# Altium project Node_TrashTrack.PrjPcb
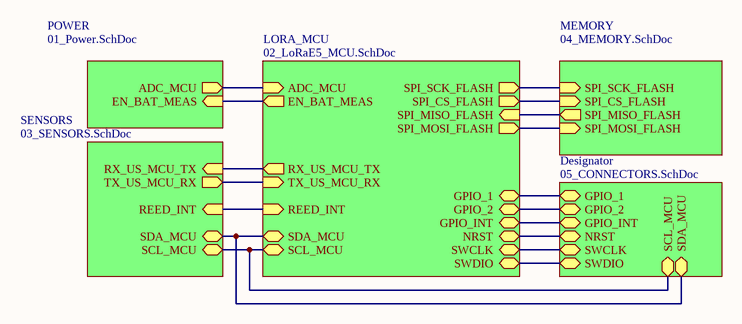
[diagram p0: 00_TOP.SchDoc]
5 sheets, 37 parts. Net scope: hierarchical (ports join the sheet entries above them; power ports are global).
Board file: Node_TrashTrack.PcbDoc
Sheets:
  00_TOP.SchDoc
    POWER = 01_Power.SchDoc
    LORA_MCU = 02_LoRaE5_MCU.SchDoc
    SENSORS = 03_SENSORS.SchDoc
    Designator = 05_CONNECTORS.SchDoc

## Sheet 00_TOP.SchDoc
size A4; SheetNumber: 1; SheetTotal: 6

### Sub-sheets
Designator = 05_CONNECTORS.SchDoc: SDA_MCU (bidir), SCL_MCU (bidir), GPIO_1 (bidir), GPIO_2 (bidir), GPIO_INT (bidir), SWCLK (bidir), SWDIO (bidir), NRST (bidir)
LORA_MCU = 02_LoRaE5_MCU.SchDoc: SCL_MCU (bidir), SDA_MCU (bidir), RX_US_MCU_TX (out), TX_US_MCU_RX (in), SPI_SCK_FLASH (out), SPI_MISO_FLASH (in), SPI_MOSI_FLASH (out), SPI_CS_FLASH (out), ADC_MCU (in), EN_BAT_MEAS (out), SWCLK (bidir), SWDIO (bidir), GPIO_1 (bidir), GPIO_2 (bidir), GPIO_INT (bidir), REED_INT (in), NRST (bidir)
MEMORY = 04_MEMORY.SchDoc (file not in this document): SPI_MISO_FLASH (out), SPI_MOSI_FLASH (in), SPI_SCK_FLASH (in), SPI_CS_FLASH (in)
POWER = 01_Power.SchDoc: ADC_MCU (out), EN_BAT_MEAS (in)
SENSORS = 03_SENSORS.SchDoc: RX_US_MCU_TX (in), TX_US_MCU_RX (out), SDA_MCU (bidir), SCL_MCU (bidir), REED_INT (in)

### Nets
bat_ADC: sheet POWER/ADC_MCU, sheet LORA_MCU/ADC_MCU
EN_BAT_MEAS_N: sheet POWER/EN_BAT_MEAS, sheet LORA_MCU/EN_BAT_MEAS
NRST: sheet LORA_MCU/NRST, sheet Designator/NRST
REED_INT: sheet LORA_MCU/REED_INT, sheet SENSORS/REED_INT
RX_US: sheet LORA_MCU/RX_US_MCU_TX, sheet SENSORS/RX_US_MCU_TX
SCL_MCU: sheet LORA_MCU/SCL_MCU, sheet SENSORS/SCL_MCU, sheet Designator/SCL_MCU
SDA_MCU: sheet LORA_MCU/SDA_MCU, sheet SENSORS/SDA_MCU, sheet Designator/SDA_MCU
SWCLK: sheet LORA_MCU/SWCLK, sheet Designator/SWCLK
SWDIO: sheet LORA_MCU/SWDIO, sheet Designator/SWDIO
TX_US: sheet LORA_MCU/TX_US_MCU_RX, sheet SENSORS/TX_US_MCU_RX
NetJ7_5: sheet LORA_MCU/GPIO_1, sheet Designator/GPIO_1
NetJ7_7: sheet LORA_MCU/GPIO_2, sheet Designator/GPIO_2
NetJ7_8: sheet LORA_MCU/GPIO_INT, sheet Designator/GPIO_INT
NetU3_24: sheet LORA_MCU/SPI_SCK_FLASH, sheet MEMORY/SPI_SCK_FLASH
NetU3_25: sheet LORA_MCU/SPI_CS_FLASH, sheet MEMORY/SPI_CS_FLASH
NetU3_26: sheet LORA_MCU/SPI_MISO_FLASH, sheet MEMORY/SPI_MISO_FLASH
NetU3_27: sheet LORA_MCU/SPI_MOSI_FLASH, sheet MEMORY/SPI_MOSI_FLASH

## Sheet 01_Power.SchDoc
size A4; SheetNumber: 3; SheetTotal: 6
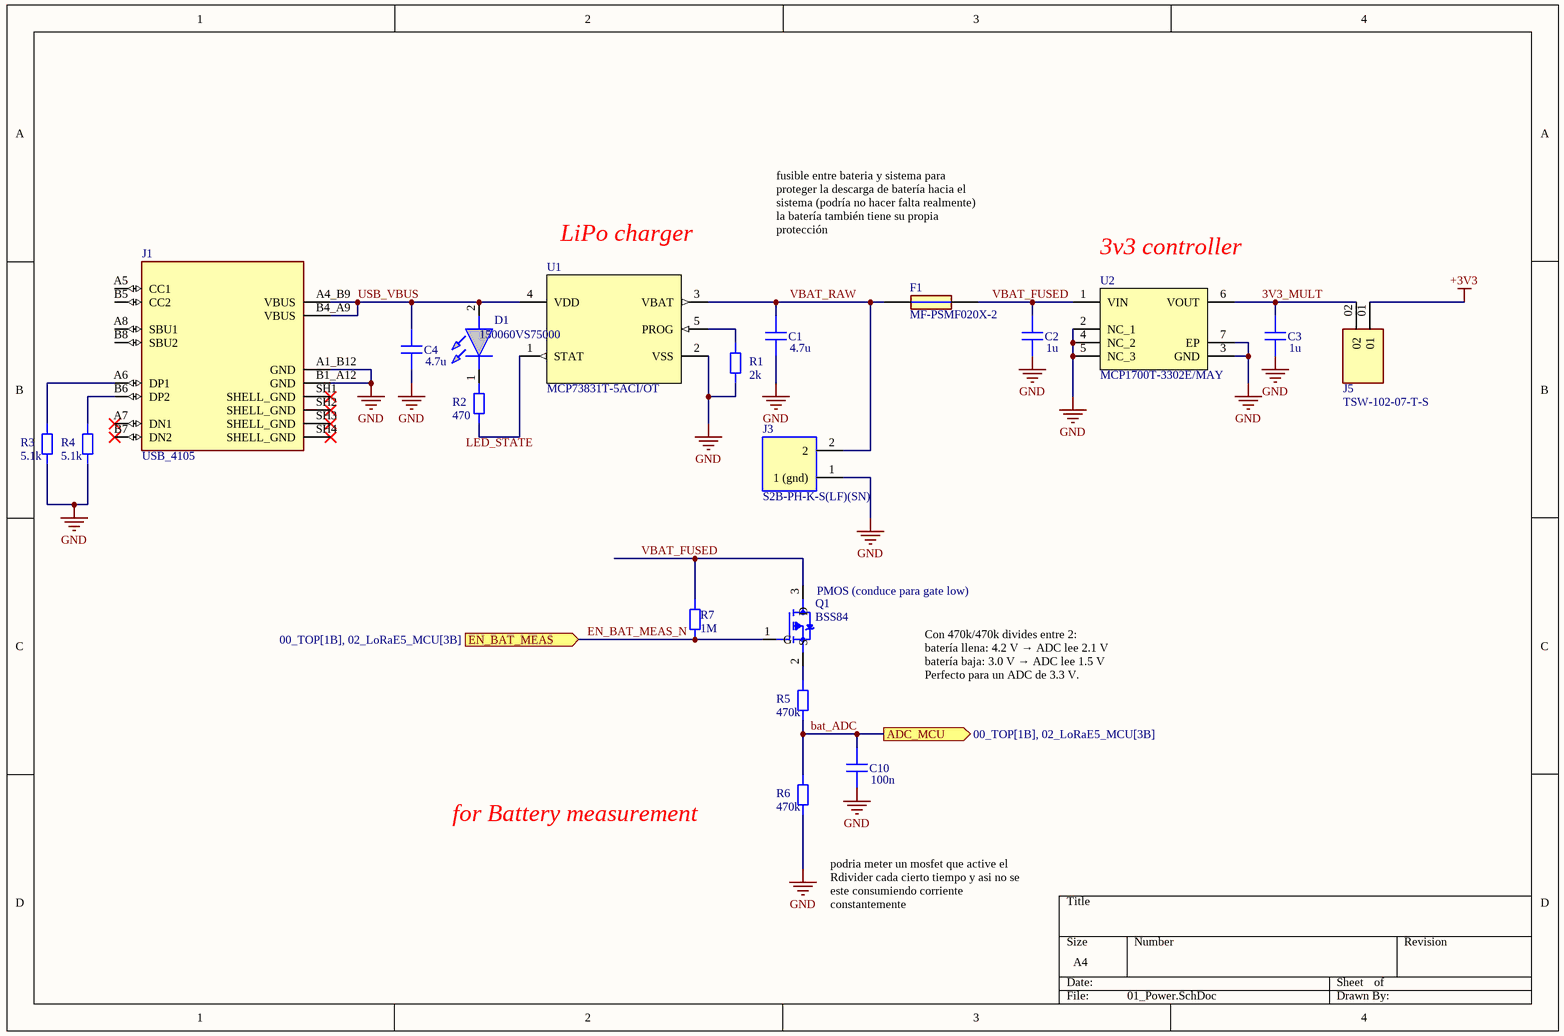
[diagram p1: 01_Power.SchDoc]

### Parts
C1  4.7u  [Capacitor_SMD:0603_1608m]
C2  1u  [Capacitor_SMD:0603_1608m]
C3  1u  [Capacitor_SMD:0603_1608m]
C4  4.7u  [Capacitor_SMD:0603_1608m]
C10  100n  [Capacitor_SMD:0603_1608m]
D1  150060VS75000  [LEDC1608X70N]
F1  MF-PSMF020X-2  [MF-PSMF020X-2]
J1  USB_4105  [USB4105-GF-A]
J3  S2B-PH-K-S(LF)(SN)  [S2B-PH-K-S(LF)(SN)]
J5  TSW-102-07-T-S  [TSW-102-07-T-S]
Q1  BSS84  [BS884]
R1  2k  [Resistor_SMD:0603_1608m]
R2  470  [Resistor_SMD:0603_1608m]
R3  5.1k  [Resistor_SMD:0603_1608m]
R4  5.1k  [Resistor_SMD:0603_1608m]
R5  470k  [Resistor_SMD:0603_1608m]
R6  470k  [Resistor_SMD:0603_1608m]
R7  1M  [Resistor_SMD:0603_1608m]
U1  MCP73831T-5ACI/OT  [MCP73831T-5ACI/OT]
U2  MCP1700T-3302E/MAY  [MCP1700T-3302E/MAY]

### Ports
ADC_MCU (out, see 00_TOP[1B], 02_LoRaE5_MCU[3B]), EN_BAT_MEAS (in, see 00_TOP[1B], 02_LoRaE5_MCU[3B])

### Nets
+3V3: J5.01
GND: C1.2 C2.2 C3.2 C4.2 C10.2 J1.A1_B12(GND) J1.B1_A12(GND) J3.1(1_(gnd)) R1.2 R3.2 R4.2 R6.2 U1.2(VSS) U2.2(NC_1) U2.3(GND) U2.4(NC_2) U2.5(NC_3) U2.7(EP)
3V3_MULT: C3.1 J5.02 U2.6(VOUT)
bat_ADC: C10.1 R5.2 R6.1 ; port ADC_MCU
EN_BAT_MEAS_N: Q1.1(G) R7.1 ; port EN_BAT_MEAS
USB_VBUS: C4.1 D1.2(A) J1.A4_B9(VBUS) J1.B4_A9(VBUS) U1.4(VDD)
VBAT_FUSED: C2.1 F1.2 Q1.3(D) R7.2 U2.1(VIN)
VBAT_RAW: C1.1 F1.1 J3.2 U1.3(VBAT)
NetD1_1: D1.1(K) R2.1
NetJ1_A6: J1.A6(DP1) R3.1
NetJ1_B6: J1.B6(DP2) R4.1
NetQ1_2: Q1.2(S) R5.1
NetR1_1: R1.1 U1.5(PROG)
NetR2_2: R2.2 U1.1(STAT)

Not connected (* = marked no-connect by the designer): J1 A5(CC1) A7(DN1)* A8(SBU1) B5(CC2) B7(DN2)* B8(SBU2) SH1(SHELL_GND)* SH2(SHELL_GND)* SH3(SHELL_GND)* SH4(SHELL_GND)*

### Notes on the sheet
- LiPo charger
- fusible entre bateria y sistema para proteger la descarga de batería hacia el sistema (podría no hacer falta realmente) la batería también tiene su propia protección
- (near U2) 3v3 controller
- (near Q1) PMOS (conduce para gate low)
- Con 470k/470k divides entre 2:
  batería llena: 4.2 V → ADC lee 2.1 V
  batería baja: 3.0 V → ADC lee 1.5 V
  Perfecto para un ADC de 3.3 V.
- for Battery measurement
- podria meter un mosfet que active el Rdivider cada cierto tiempo y asi no se este consumiendo corriente constantemente
- Labels drawn without touching a wire or pin: LED_STATE

### Library data of the parts
C1-C4 C10 = Generic_Capacitor
D1 = 150060VS75000: WL-SMCW SMT Mono-Color Chip LED Waterclear 0603, Bright Green, Typ.(@20mA): 570nm, 40mcd, 2.0V, 140 AlInGaP; Manufacturer_Name: Wurth Elektronik; Geometry.Height: 0.7mm; Manufacturer_Part_Number: 150060VS75000; Mouser Part Number: 710-150060VS75000; Mouser Price/Stock: https://www.mouser.co.uk/ProductDetail/Wurth-Elektronik/150060VS75000?qs=LlUlMxKIyB1Q1Bi5mQ%2FKLw%3D%3D; Arrow Part Number: *; Arrow Price/Stock: *; Datasheet Link: https://www.we-online.com/catalog/datasheet/150060VS75000.pdf
F1 = MF-PSMF020X-2: Manufacturer_Name: Bourns; Geometry.Height: 0.85mm; Manufacturer_Part_Number: MF-PSMF020X-2; Mouser Part Number: 652-MF-PSMF020X-2; Mouser Price/Stock: https://www.mouser.co.uk/ProductDetail/Bourns/MF-PSMF020X-2?qs=B2dI1vFk2x%2FnZ%252B%252BDoGvxDQ%3D%3D; Arrow Part Number: MF-PSMF020X-2; Arrow Price/Stock: https://www.arrow.com/en/products/mf-psmf020x-2/bourns?utm_currency=USD&region=europe; Datasheet Link: https://www.bourns.com/pdfs/mfpsmf.pdf
J5 = TSW-102-07-T-S: <a href="https://pricing.snapeda.com/parts/TSW-102-07-T-S/Samtec/view-part?ref=eda">Check availability</a>; MF: {'manufacturer': u'Samtec'}; Package: None; Price: None; Value: *; MP: TSW-102-07-T-S; Availability: Unavailable
Q1 = BSS84: P-Channel 50 V 130mA (Ta) 225mW (Ta) Surface Mount SOT-23-3 (TO-236); MF: onsemi; SnapEDA_Link: https://www.snapeda.com/parts/BSS84/Onsemi/view-part/?ref=snap; Package: None; Value: *; MP: BSS84; Check_prices: https://www.snapeda.com/parts/BSS84/Onsemi/view-part/?ref=eda
R1-R7 = Generic Resistor

## Sheet 02_LoRaE5_MCU.SchDoc
size A4; SheetNumber: 4; SheetTotal: 6
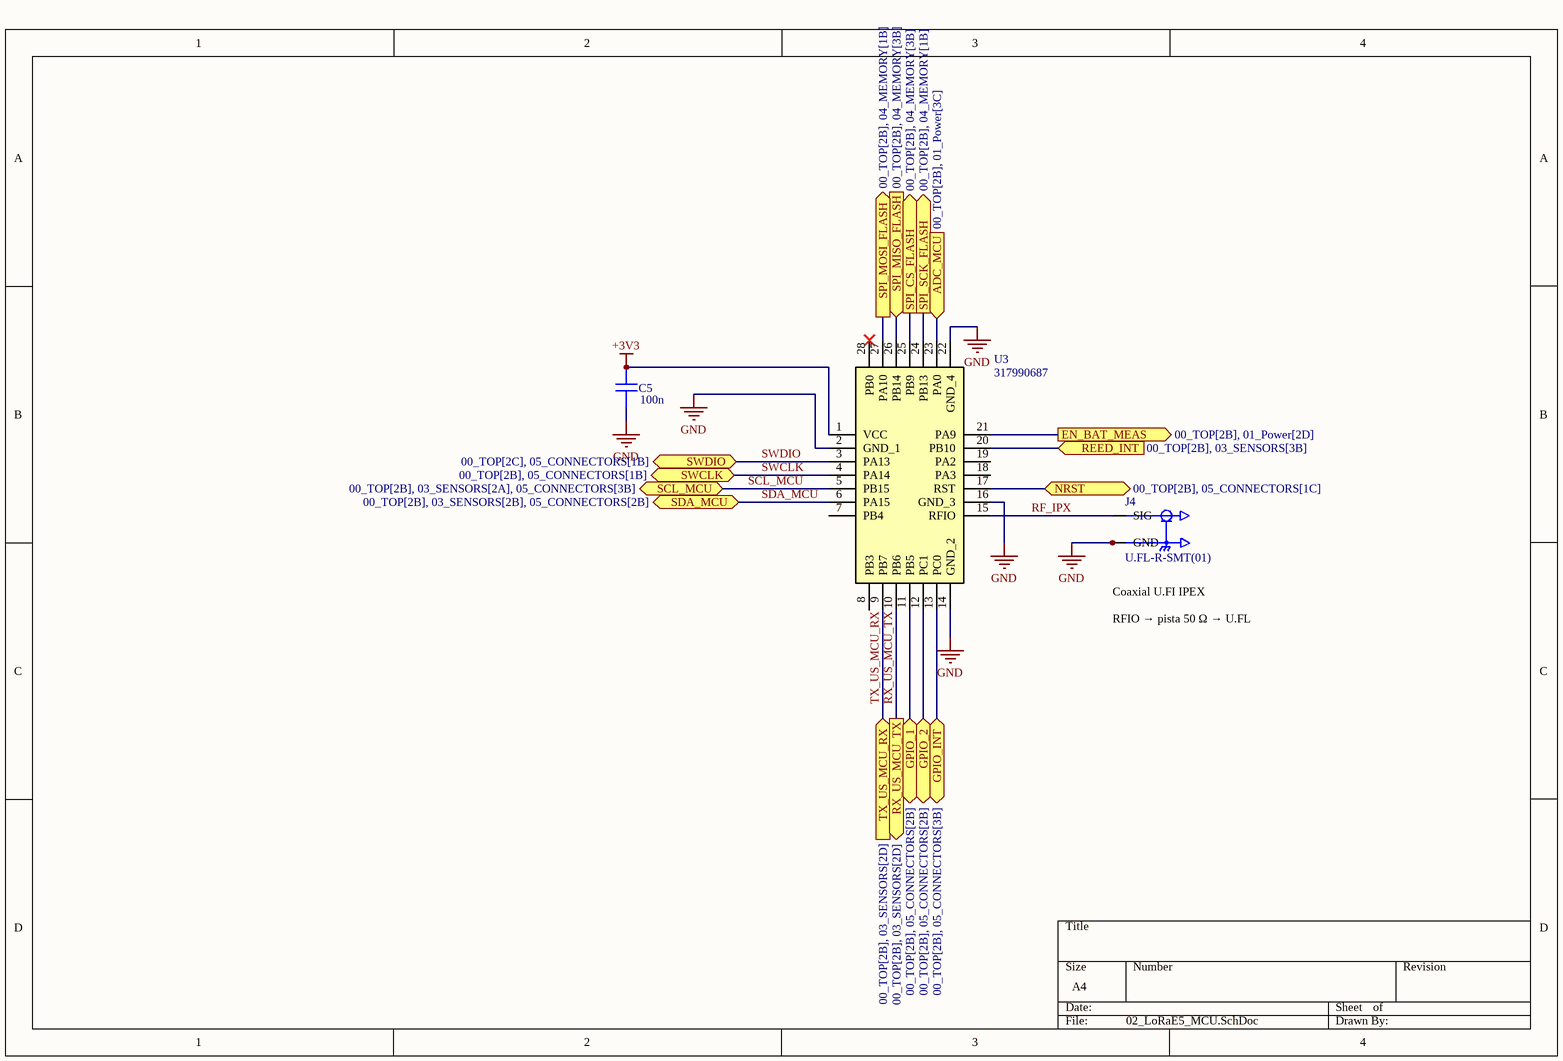
[diagram p2: 02_LoRaE5_MCU.SchDoc]

### Parts
C5  100n  [Capacitor_SMD:0603_1608m]
J4  U.FL-R-SMT(01)  [U.FL-R-SMT(01)]
U3  317990687  [317990687]

### Ports
ADC_MCU (in, see 00_TOP[2B], 01_Power[3C]), EN_BAT_MEAS (out, see 00_TOP[2B], 01_Power[2D]), GPIO_1 (bidir, see 00_TOP[2B], 05_CONNECTORS[2B]), GPIO_2 (bidir, see 00_TOP[2B], 05_CONNECTORS[2B]), GPIO_INT (bidir, see 00_TOP[2B], 05_CONNECTORS[3B]), NRST (bidir, see 00_TOP[2B], 05_CONNECTORS[1C]), REED_INT (in, see 00_TOP[2B], 03_SENSORS[3B]), RX_US_MCU_TX (out, see 00_TOP[2B], 03_SENSORS[2D]), SCL_MCU (bidir, see 00_TOP[2B], 03_SENSORS[2A], 05_CONNECTORS[3B]), SDA_MCU (bidir, see 00_TOP[2B], 03_SENSORS[2B], 05_CONNECTORS[2B]), SPI_CS_FLASH (out, see 00_TOP[2B], 04_MEMORY[3B]), SPI_MISO_FLASH (in, see 00_TOP[2B], 04_MEMORY[3B]), SPI_MOSI_FLASH (out, see 00_TOP[2B], 04_MEMORY[1B]), SPI_SCK_FLASH (out, see 00_TOP[2B], 04_MEMORY[1B]), SWCLK (bidir, see 00_TOP[2B], 05_CONNECTORS[1B]), SWDIO (bidir, see 00_TOP[2C], 05_CONNECTORS[1B]), TX_US_MCU_RX (in, see 00_TOP[2B], 03_SENSORS[2D])

### Nets
+3V3: C5.1 U3.1(VCC)
GND: C5.2 J4.1(GND) J4.2(GND) U3.2(GND_1) U3.14(GND_2) U3.16(GND_3) U3.22(GND_4)
bat_ADC: U3.23(PA0) ; port ADC_MCU
EN_BAT_MEAS_N: U3.21(PA9) ; port EN_BAT_MEAS
NRST: U3.17(RST) ; port NRST
REED_INT: U3.20(PB10) ; port REED_INT
RF_IPX: J4.3(SIG) U3.15(RFIO)
RX_US_MCU_TX: U3.10(PB6) ; port RX_US_MCU_TX  [project net RX_US]
SCL_MCU: U3.5(PB15) ; port SCL_MCU
SDA_MCU: U3.6(PA15) ; port SDA_MCU
SWCLK: U3.4(PA14) ; port SWCLK
SWDIO: U3.3(PA13) ; port SWDIO
TX_US_MCU_RX: U3.9(PB7) ; port TX_US_MCU_RX  [project net TX_US]
NetJ7_5: U3.11(PB5) ; port GPIO_1
NetJ7_7: U3.12(PC1) ; port GPIO_2
NetJ7_8: U3.13(PC0) ; port GPIO_INT
NetU3_24: U3.24(PB13) ; port SPI_SCK_FLASH
NetU3_25: U3.25(PB9) ; port SPI_CS_FLASH
NetU3_26: U3.26(PB14) ; port SPI_MISO_FLASH
NetU3_27: U3.27(PA10) ; port SPI_MOSI_FLASH

Not connected (* = marked no-connect by the designer): U3 7(PB4) 8(PB3) 18(PA3) 19(PA2) 28(PB0)*

### Notes on the sheet
- (near J4) Coaxial U.FI IPEX
- RFIO → pista 50 Ω → U.FL

### Library data of the parts
C5 = Generic_Capacitor
J4 = U.FL-R-SMT(01): MF: Hirose; Check_prices: https://www.snapeda.com/parts/U.FL-R-SMT(01)/Hirose+Electric+Co+Ltd/view-part/?ref=eda; Value: *; Availability: In Stock; MP: U.FL-R-SMT(01); Price: None; Package: None; SnapEDA_Link: https://www.snapeda.com/parts/U.FL-R-SMT(01)/Hirose+Electric+Co+Ltd/view-part/?ref=snap; Purchase-URL: https://pricing.snapeda.com/search/part/U.FL-R-SMT(01)/?ref=eda

## Sheet 03_SENSORS.SchDoc
size A4; SheetNumber: 5; SheetTotal: 6
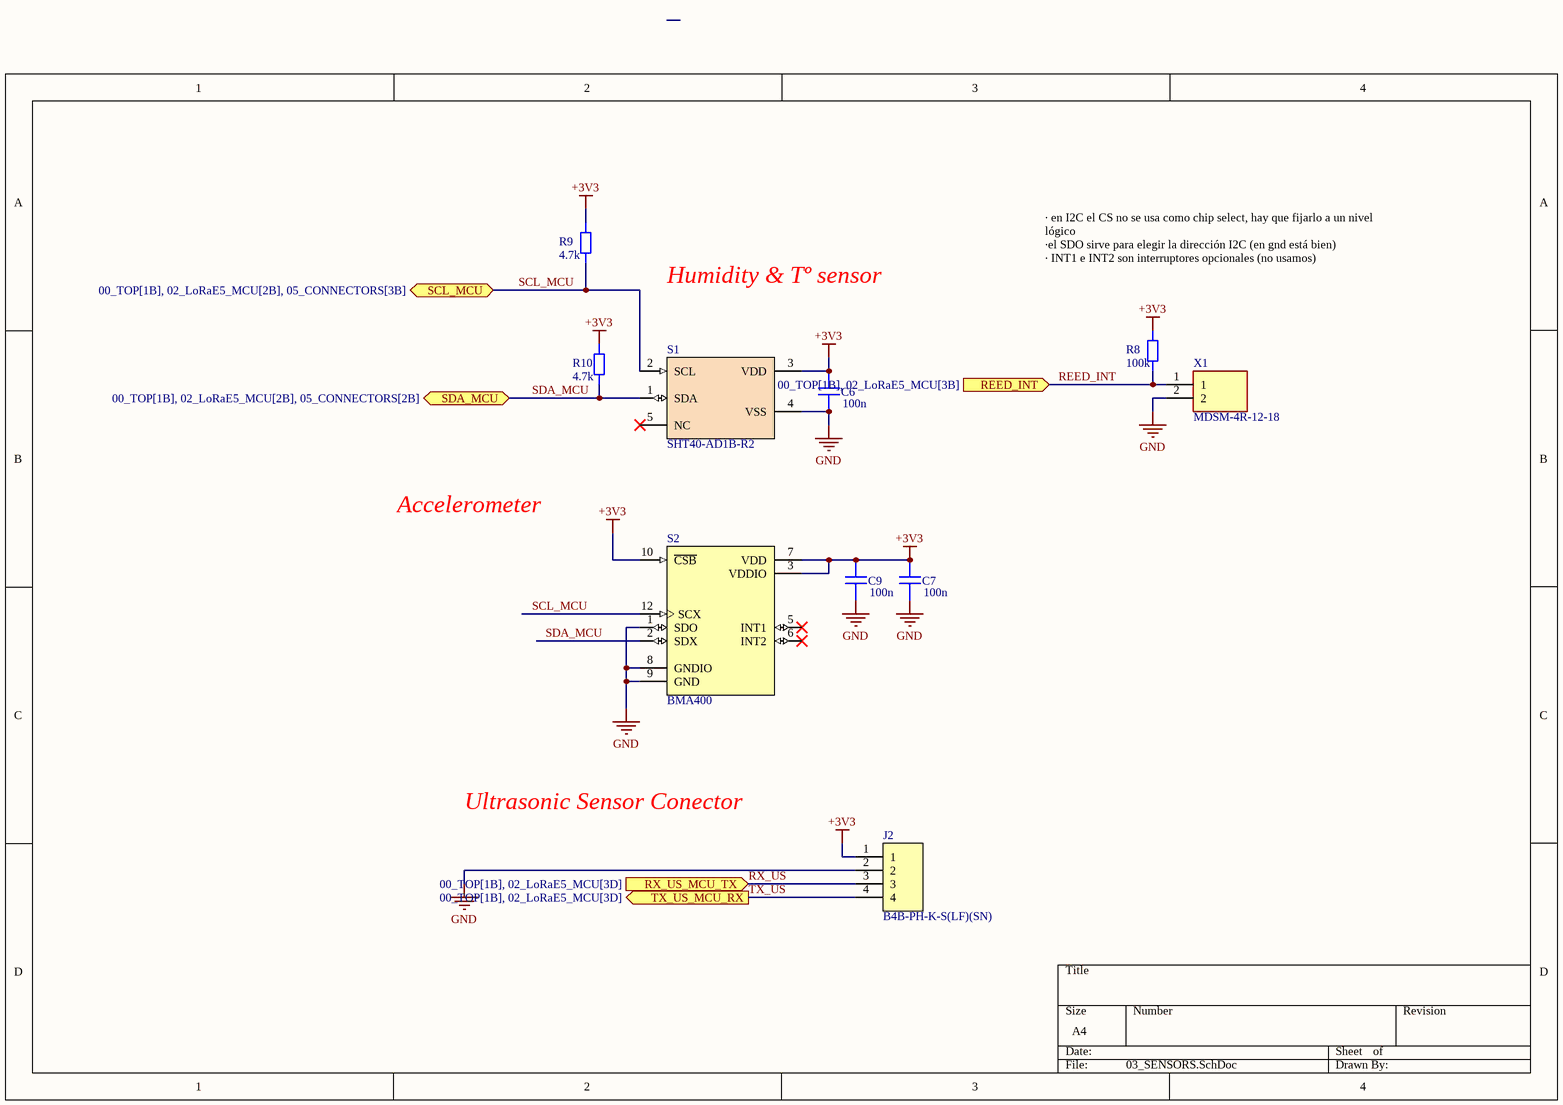
[diagram p3: 03_SENSORS.SchDoc]

### Parts
C6  100n  [Capacitor_SMD:0603_1608m]
C7  100n  [Capacitor_SMD:0603_1608m]
C9  100n  [Capacitor_SMD:0603_1608m]
J2  B4B-PH-K-S(LF)(SN)  [B4B-PH-K-S(LF)(SN)]
R8  100k  [Resistor_SMD:0603_1608m]
R9  4.7k  [Resistor_SMD:0603_1608m]
R10  4.7k  [Resistor_SMD:0603_1608m]
S1  SHT40-AD1B-R2  [SHT4x_SEN]
S2  BMA400  [BMA400]
X1  MDSM-4R-12-18  [MDSM4R1218]

### Ports
REED_INT (in, see 00_TOP[1B], 02_LoRaE5_MCU[3B]), RX_US_MCU_TX (in, see 00_TOP[1B], 02_LoRaE5_MCU[3D]), SCL_MCU (bidir, see 00_TOP[1B], 02_LoRaE5_MCU[2B], 05_CONNECTORS[3B]), SDA_MCU (bidir, see 00_TOP[1B], 02_LoRaE5_MCU[2B], 05_CONNECTORS[2B]), TX_US_MCU_RX (out, see 00_TOP[1B], 02_LoRaE5_MCU[3D])

### Nets
+3V3: C6.1 C7.1 C9.1 J2.1 R8.1 R9.1 R10.1 S1.3(VDD) S2.3(VDDIO) S2.7(VDD) S2.10(~{CSB})
GND: C6.2 C7.2 C9.2 J2.2 S1.4(VSS) S2.1(SDO) S2.8(GNDIO) S2.9(GND) X1.2
REED_INT: R8.2 X1.1 ; port REED_INT
RX_US: J2.3 ; port RX_US_MCU_TX
SCL_MCU: R9.2 S1.2(SCL) S2.12(SCX) ; port SCL_MCU
SDA_MCU: R10.2 S1.1(SDA) S2.2(SDX) ; port SDA_MCU
TX_US: J2.4 ; port TX_US_MCU_RX

Not connected (* = marked no-connect by the designer): S1 5(NC)*; S2 5(INT1)* 6(INT2)*

### Notes on the sheet
- Humidity & Tº sensor
- · en I2C el CS no se usa como chip select, hay que fijarlo a un nivel lógico
  ·el SDO sirve para elegir la dirección I2C (en gnd está bien)
  · INT1 e INT2 son interruptores opcionales (no usamos)
- Accelerometer
- Ultrasonic Sensor Conector

### Library data of the parts
C6 C7 C9 = Generic_Capacitor
R8-R10 = Generic Resistor
X1 = MDSM-4R-12-18: LITTELFUSE - MDSM-4R-12-18 - REED SW, SPST-NO, 0.5A, 200VDC, SMD; Geometry.Height: 2.84mm; Manufacturer_Name: LITTELFUSE; Manufacturer_Part_Number: MDSM-4R-12-18; Mouser Part Number: 934-MDSM-4R12-18; Mouser Price/Stock: https://www.mouser.co.uk/ProductDetail/Littelfuse/MDSM-4R-12-18?qs=nyo4TFax6NeuFOer0%2FvGlw%3D%3D; Arrow Part Number: MDSM-4R-12-18; Arrow Price/Stock: https://www.arrow.com/en/products/mdsm-4r-12-18/littelfuse?region=europe; Datasheet Link: https://media.digikey.com/pdf/DataSheets/HamlinPDFs/MDSM-4R.pdf

## Sheet 05_CONNECTORS.SchDoc
size A4; SheetNumber: 2; SheetTotal: 6
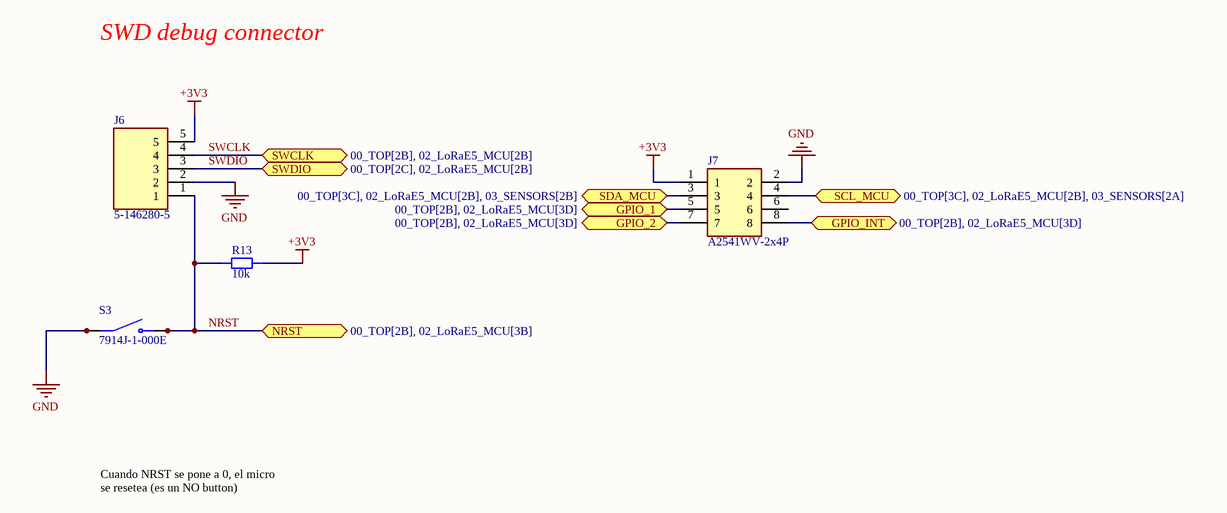
[diagram p4: 05_CONNECTORS.SchDoc]

### Parts
J6  5-146280-5  [HDRV5W67P0X254_1X5_1229X234X821P]
J7  A2541WV-2x4P  [TSW-104-XX-YY-D]
R13  10k  [Resistor_SMD:0603_1608m]
S3  7914J-1-000E  [SW_7914J-1-000E]

### Ports
GPIO_1 (bidir, see 00_TOP[2B], 02_LoRaE5_MCU[3D]), GPIO_2 (bidir, see 00_TOP[2B], 02_LoRaE5_MCU[3D]), GPIO_INT (bidir, see 00_TOP[2B], 02_LoRaE5_MCU[3D]), NRST (bidir, see 00_TOP[2B], 02_LoRaE5_MCU[3B]), SCL_MCU (bidir, see 00_TOP[3C], 02_LoRaE5_MCU[2B], 03_SENSORS[2A]), SDA_MCU (bidir, see 00_TOP[3C], 02_LoRaE5_MCU[2B], 03_SENSORS[2B]), SWCLK (bidir, see 00_TOP[2B], 02_LoRaE5_MCU[2B]), SWDIO (bidir, see 00_TOP[2C], 02_LoRaE5_MCU[2B])

### Nets
+3V3: J6.5 J7.1 R13.2
GND: J6.2 J7.2 S3.1(COM) S3.2(COM)
NRST: J6.1 R13.1 S3.3(NO) S3.4(NO) ; port NRST
SCL_MCU: J7.4 ; port SCL_MCU
SDA_MCU: J7.3 ; port SDA_MCU
SWCLK: J6.4 ; port SWCLK
SWDIO: J6.3 ; port SWDIO
NetJ7_5: J7.5 ; port GPIO_1
NetJ7_7: J7.7 ; port GPIO_2
NetJ7_8: J7.8 ; port GPIO_INT

Not connected (* = marked no-connect by the designer): J7 6

### Notes on the sheet
- SWD debug connector
- Cuando NRST se pone a 0, el micro se resetea (es un NO button)

### Library data of the parts
J6 = 5-146280-5: TE CONNECTIVITY - 5-146280-5 - CONNECTOR, BOARD-TO-BOARD 07AH5929; Geometry.Height: 8.21mm; Manufacturer_Name: TE Connectivity; Manufacturer_Part_Number: 5-146280-5; Mouser Part Number: 571-5-146280-5; Mouser Price/Stock: https://www.mouser.co.uk/ProductDetail/TE-Connectivity/5-146280-5?qs=bwpFY26eRVfu6g6nYAoViA%3D%3D; Arrow Part Number: 5-146280-5; Arrow Price/Stock: https://www.arrow.com/en/products/5-146280-5/te-connectivity?utm_currency=USD&region=nac; Datasheet Link: https://www.te.com/commerce/DocumentDelivery/DDEController?Action=showdoc&DocId=Customer+Drawing%7F146280%7FH2%7Fpdf%7FEnglish%7FENG_CD_146280_H2.pdf%7F5-146280-5
J7 = TSW-104-07-T-D: Manufacturer_Name: SAMTEC; Manufacturer_Part_Number: TSW-104-07-T-D; Mouser Part Number: 200-TSW10407TD; Mouser Price/Stock: https://www.mouser.co.uk/ProductDetail/Samtec/TSW-104-07-T-D?qs=hzq9O0YpnZtBZCcLzm8dag%3D%3D; Arrow Part Number: TSW-104-07-T-D; Arrow Price/Stock: https://www.arrow.com/en/products/tsw-104-07-t-d/samtec?utm_currency=USD&region=europe; Datasheet Link: http://suddendocs.samtec.com/prints/tsw-xxx-xx-xxx-x-xx-xxx-mkt.pdf
R13 = Generic Resistor
S3 = 7914J-1-000E: Switch Tactile N.O. SPST Round Button J-Hook 0.1A 16VAC 16VDC 100000Cycles 2.94N SMD T/R; MF: Bourns; MP: 7914J-1-000E.; SnapEDA_Link: https://www.snapeda.com/parts/7914J-1-000E./Bourns/view-part/?ref=snap; Package: None; Value: *; Check_prices: https://www.snapeda.com/parts/7914J-1-000E./Bourns/view-part/?ref=eda

## Nets that join several sheets
+3V3: 01_Power (J5.01), 02_LoRaE5_MCU (C5.1 U3.1), 03_SENSORS (11 pins), 05_CONNECTORS (J6.5 J7.1 R13.2)
GND: 01_Power (18 pins), 02_LoRaE5_MCU (7 pins), 03_SENSORS (9 pins), 05_CONNECTORS (J6.2 J7.2 S3.1 S3.2)
bat_ADC: 01_Power (C10.1 R5.2 R6.1), 02_LoRaE5_MCU (U3.23)
EN_BAT_MEAS_N: 01_Power (Q1.1 R7.1), 02_LoRaE5_MCU (U3.21)
NetJ7_5: 02_LoRaE5_MCU (U3.11), 05_CONNECTORS (J7.5)
NetJ7_7: 02_LoRaE5_MCU (U3.12), 05_CONNECTORS (J7.7)
NetJ7_8: 02_LoRaE5_MCU (U3.13), 05_CONNECTORS (J7.8)
NRST: 02_LoRaE5_MCU (U3.17), 05_CONNECTORS (J6.1 R13.1 S3.3 S3.4)
REED_INT: 02_LoRaE5_MCU (U3.20), 03_SENSORS (R8.2 X1.1)
RX_US: 02_LoRaE5_MCU (U3.10), 03_SENSORS (J2.3)
SCL_MCU: 02_LoRaE5_MCU (U3.5), 03_SENSORS (R9.2 S1.2 S2.12), 05_CONNECTORS (J7.4)
SDA_MCU: 02_LoRaE5_MCU (U3.6), 03_SENSORS (R10.2 S1.1 S2.2), 05_CONNECTORS (J7.3)
SWCLK: 02_LoRaE5_MCU (U3.4), 05_CONNECTORS (J6.4)
SWDIO: 02_LoRaE5_MCU (U3.3), 05_CONNECTORS (J6.3)
TX_US: 02_LoRaE5_MCU (U3.9), 03_SENSORS (J2.4)